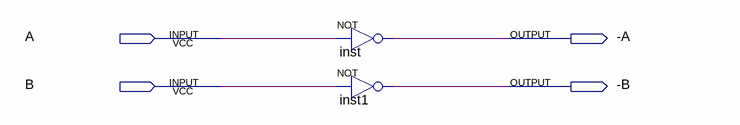
[diagram p0: schematic sheet]
// Quartus schematic Not2.bdf as structural Verilog: 2 symbols, 4 pins
module Not2 (
  input  A,
  input  B,
  output \-A ,
  output \-B 
);

  not inst (\-A , A);
  not inst1 (\-B , B);
endmodule
